# Altium project updated_loraxbee.PrjPcb
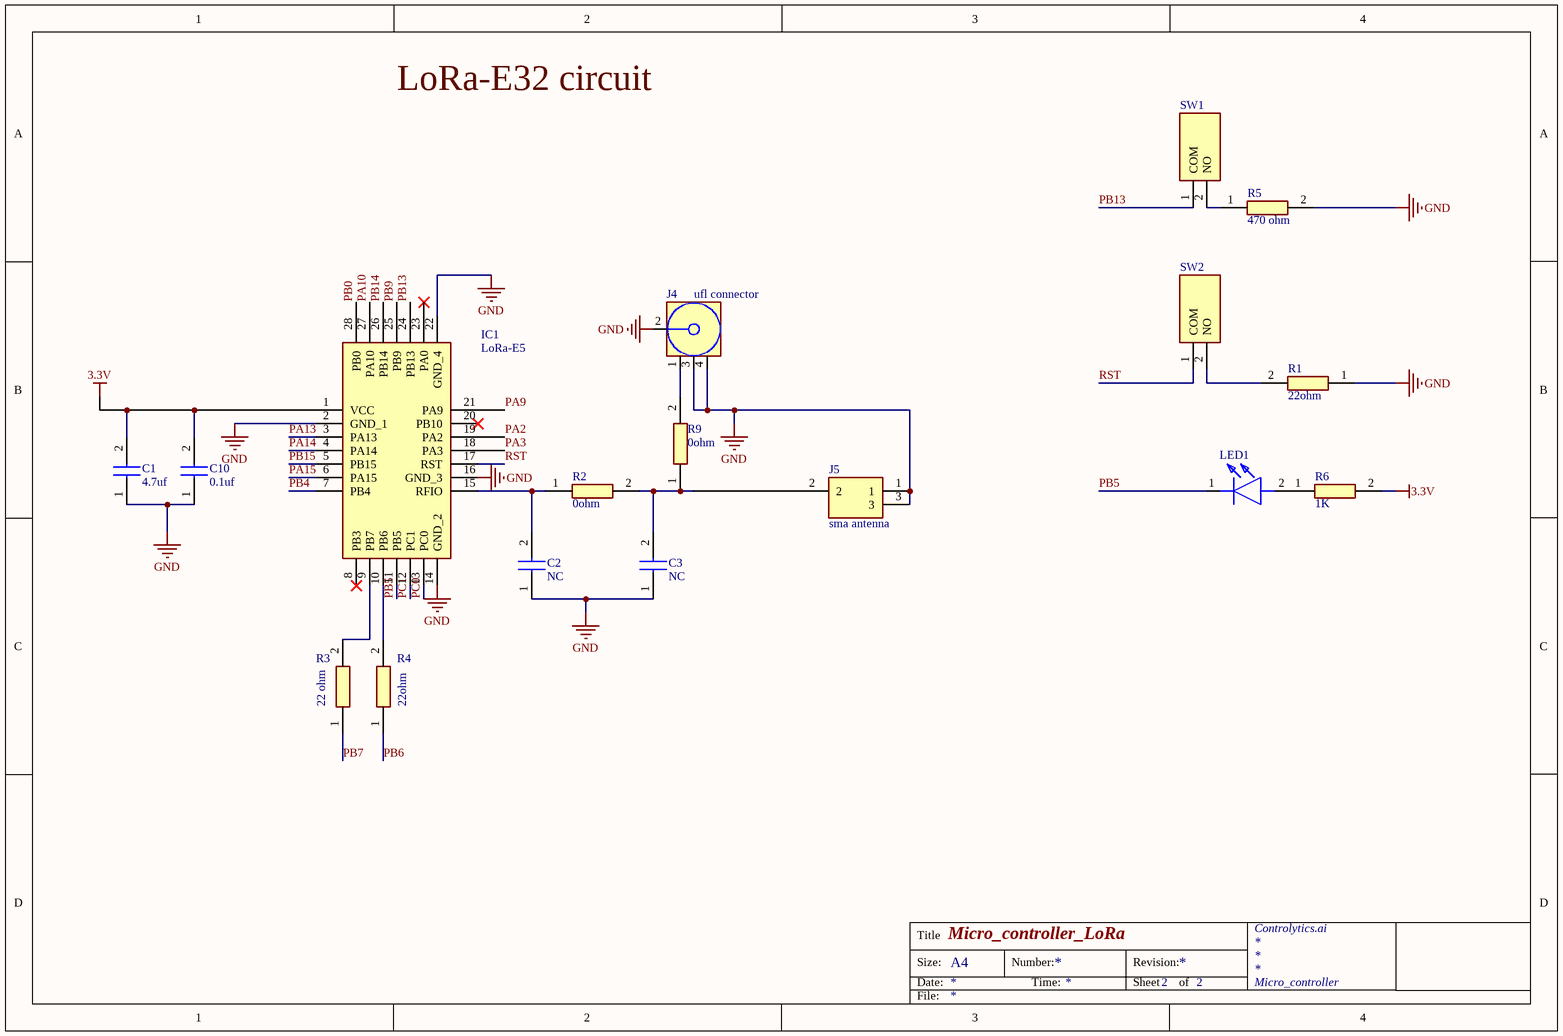
[diagram p0: updatedLoraXbee.SchDoc]
2 sheets, 30 parts. Net scope: global (net labels, ports and power ports of the same name join across sheets).
Board file: updated_lloraxbee2.PcbDoc
Sheets:
  updatedLoraXbee.SchDoc
  updated_loraxbee_ldo sheet.SchDoc

## Sheet updatedLoraXbee.SchDoc: Micro_controller_LoRa
size A4; Organization: Controlytics.ai; Address4: Micro_controller; SheetNumber: 2; SheetTotal: 2

### Parts
C1  4.7uf  [CAPC1608X100N]
C2  NC  [CAPC1608X90N]
C3  NC  [CAPC1608X90N]
C10  0.1uf  [CAPC1608X100N]
IC1  LoRa-E5  [LoRaE5]
J4  ufl connector  [SMA_EDGE_5_6.4x7.8]
J5  sma antenna  [1909763-1]
LED1  FKR1111C-TR  [LED-0603-BLUE]  (value not drawn)
R1  22ohm  [RESC1609X55N]
R2  0ohm  [RESC1608X55N]
R3  22 ohm  [RESC1609X55N]
R4  22ohm  [RESC1609X55N]
R5  470 ohm  [RESC1608X55N]
R6  1K  [ERA3AEB101V]
R9  0ohm  [RESC1608X55N]
SW1  PTS636_SK25F_SMTR_LFS  [PTS636SK25FSMTRLFS]  (value not drawn)
SW2  PTS636_SK25F_SMTR_LFS  [PTS636SK25FSMTRLFS]  (value not drawn)

### Nets
3.3V: C1.2 C10.2 IC1.1(VCC) R6.2
GND: C1.1 C2.1 C3.1 C10.1 IC1.2(GND_1) IC1.14(GND_2) IC1.16(GND_3) IC1.22(GND_4) J4.2(Signal) J4.3(GND) J4.4(GND) J5.1 J5.3 R1.1 R5.2
PA2: IC1.19(PA2)
PA3: IC1.18(PA3)
PA9: IC1.21(PA9)
PA10: IC1.27(PA10)
PA13: IC1.3(PA13)
PA14: IC1.4(PA14)
PA15: IC1.6(PA15)
PB0: IC1.28(PB0)
PB4: IC1.7(PB4)
PB5: IC1.11(PB5) LED1.1(K)
PB6: R4.1
PB7: R3.1
PB9: IC1.25(PB9)
PB13: IC1.24(PB13) SW1.1(COM)
PB14: IC1.26(PB14)
PB15: IC1.5(PB15)
PC0: IC1.13(PC0)
PC1: IC1.12(PC1)
RST: IC1.17(RST) SW2.1(COM)
NetC2_2: C2.2 IC1.15(RFIO) R2.1
NetC3_2: C3.2 J5.2 R2.2 R9.1
NetIC1_9: IC1.9(PB7) R3.2
NetIC1_10: IC1.10(PB6) R4.2
NetJ4_1: J4.1(GND) R9.2
NetLED1_2: LED1.2(A) R6.1
NetR1_2: R1.2 SW2.2(NO)
NetR5_1: R5.1 SW1.2(NO)

Not connected (* = marked no-connect by the designer): IC1 8(PB3)* 20(PB10)* 23(PA0)*

### Notes on the sheet
- LoRa-E32 circuit
- Title
- Size:
- Date:
- A4
- Number:
- Time:
- Revision:
- Sheet
- of
- File:

### Library data of the parts
C1 C10 = GCJ188C70J475KE02D: Capacitor; Manufacturer_Name: Murata Electronics; Datasheet Link: https://psearch.en.murata.com/capacitor/product/GCJ188C70J475KE02%23.html; Height: 1mm; Manufacturer_Part_Number: GCJ188C70J475KE02D; Mouser Part Number: 81-GCJ188C70J475KE2D; Mouser Price/Stock: https://www.mouser.co.uk/ProductDetail/Murata-Electronics/GCJ188C70J475KE02D?qs=QzBtWTOodeVfJR8CElrI4A%3D%3D; Arrow Part Number: GCJ188C70J475KE02D; Arrow Price/Stock: https://www.arrow.com/en/products/gcj188c70j475ke02d/murata-manufacturing?region=nac
C2 C3 = GRM188R71C104MA01D: Capacitor; Manufacturer_Name: Murata Electronics; Datasheet Link: http://componentsearchengine.com/Datasheets/1/GRM188R71C104MA01D.pdf; Height: 0.9mm; Manufacturer_Part_Number: GRM188R71C104MA01D; Mouser Part Number: 81-GRM18R71C104MA01D; Mouser Price/Stock: https://www.mouser.com/Search/Refine.aspx?Keyword=81-GRM18R71C104MA01D; Arrow Part Number: GRM188R71C104MA01D; Arrow Price/Stock: https://www.arrow.com/en/products/grm188r71c104ma01d/murata-manufacturing
IC1 = LoRa-E5: Integrated Circuit; Manufacturer_Name: Seeed Studio; Datasheet Link: https://no.mouser.com/datasheet/2/744/LoRa_E5_module_datasheet_V1_0-2488126.pdf; Height: 2.5mm; Manufacturer_Part_Number: LoRa-E5
J4 = SMA_CON_4: ComponentLink1URL: http://www.amphenolrf.com/media/downloads/3672/132372-11.pdf; ComponentLink1Description: http://www.amphenolrf.com/media/downloads/3672/132372-11.pdf
J5 = 1909763-1: Connector; Manufacturer_Name: TE Connectivity; Datasheet Link: http://www.te.com/commerce/DocumentDelivery/DDEController?Action=srchrtrv&DocNm=1909763&DocType=Customer+Drawing&DocLang=English; Manufacturer_Part_Number: 1909763-1; Mouser Part Number: 571-1909763-1; Mouser Price/Stock: https://www.mouser.co.uk/ProductDetail/TE-Connectivity-AMP/1909763-1?qs=zR8VgEwoOb2%252BUqFkM9%2F6jQ%3D%3D; Arrow Part Number: 1909763-1; Arrow Price/Stock: https://www.arrow.com/en/products/1909763-1/te-connectivity?region=nac
LED1 = FKR1111C-TR: LED; Manufacturer_Name: Stanley Electric; Datasheet Link: http://www.stanley-components.com/php/downloaddatafile.php?rp=0,FKR1111C-TR_e.pdf; Height: 0.8mm; Manufacturer_Part_Number: FKR1111C-TR; Mouser Part Number: 327-FKR1111CTR; Mouser Price/Stock: https://www.mouser.co.uk/ProductDetail/Stanley-Electric/FKR1111C-TR?qs=byeeYqUIh0N4LNttpqKOoA%3D%3D; Arrow Part Number: FKR1111C-TR; Arrow Price/Stock: https://www.arrow.com/en/products/fkr1111c-tr/stanley-electric?region=nac
R1 R3 R4 = ERJ-P03J220V: Resistor; Manufacturer_Name: Panasonic; Datasheet Link: http://industrial.panasonic.com/cdbs/www-data/pdf/RDA0000/AOA0000C102.pdf; Height: 0.55mm; Manufacturer_Part_Number: ERJ-P03J220V; Mouser Part Number: 667-ERJ-P03J220V; Mouser Price/Stock: https://www.mouser.co.uk/ProductDetail/Panasonic/ERJ-P03J220V?qs=18kBAoNi3c8s2FjgUUqr2Q%3D%3D
R2 R9 = MCT0603HZ0000ZP500: Resistor; Manufacturer_Name: Vishay; Datasheet Link: http://www.vishay.com/docs/28705/mcx0x0xpro.pdf; Height: 0.55mm; Manufacturer_Part_Number: MCT0603HZ0000ZP500; Mouser Part Number: 594-MCT0603HZ0000ZP5; Mouser Price/Stock: https://www.mouser.co.uk/ProductDetail/Vishay-Beyschlag/MCT0603HZ0000ZP500?qs=xy8ZAJ6gwchPwuxyJv%252BYaw%3D%3D; Arrow Part Number: MCT0603HZ0000ZP500; Arrow Price/Stock: https://www.arrow.com/en/products/mct0603hz0000zp500/vishay?region=nac
R5 = ERJ-S03F4700V: Resistor; Manufacturer_Name: Panasonic; Datasheet Link: https://industrial.panasonic.com/cdbs/www-data/pdf/RDP0000/AOA0000C334.pdf; Height: 0.55mm; Manufacturer_Part_Number: ERJ-S03F4700V; Mouser Part Number: 667-ERJ-S03F4700V; Mouser Price/Stock: https://www.mouser.co.uk/ProductDetail/Panasonic/ERJ-S03F4700V?qs=Zyl8A9hlmJo8QyiDzgvbZA%3D%3D
R6 = ERA-3AED102V: Resistor; Manufacturer_Name: Panasonic; Datasheet Link: https://industrial.panasonic.com/cdbs/www-data/pdf/RDM0000/AOA0000C307.pdf; Height: 0.55mm; Manufacturer_Part_Number: ERA-3AED102V; Mouser Part Number: 667-ERA-3AED102V; Mouser Price/Stock: https://www.mouser.co.uk/ProductDetail/Panasonic/ERA-3AED102V?qs=yocZuyCaXdNrh6oeFjCchg%3D%3D; Arrow Part Number: ERA-3AED102V; Arrow Price/Stock: https://www.arrow.com/en/products/era3aed102v/panasonic?region=nac
SW1 SW2 = SW1_PTS636_SK25F_SMTR_LFS-SMT: Switch; Manufacturer_Name: C & K COMPONENTS; Manufacturer_Part_Number: PTS636 SK25F SMTR LFS; Datasheet Link: https://www.mouser.com/datasheet/2/60/pts636-1550567.pdf; Height: 2.7mm; Mouser Part Number: 611-PTS636SK25FSMTRL; Mouser Price/Stock: https://www.mouser.co.uk/ProductDetail/CK/PTS636-SK25F-SMTR-LFS?qs=vLWxofP3U2zO9PvdsA2GhQ%3D%3D; Arrow Part Number: PTS636 SK25F SMTR LFS; Arrow Price/Stock: https://www.arrow.com/en/products/pts636-sk25f-smtr-lfs/ck

## Sheet updated_loraxbee_ldo sheet.SchDoc
size A4; SheetNumber: 1; SheetTotal: 2
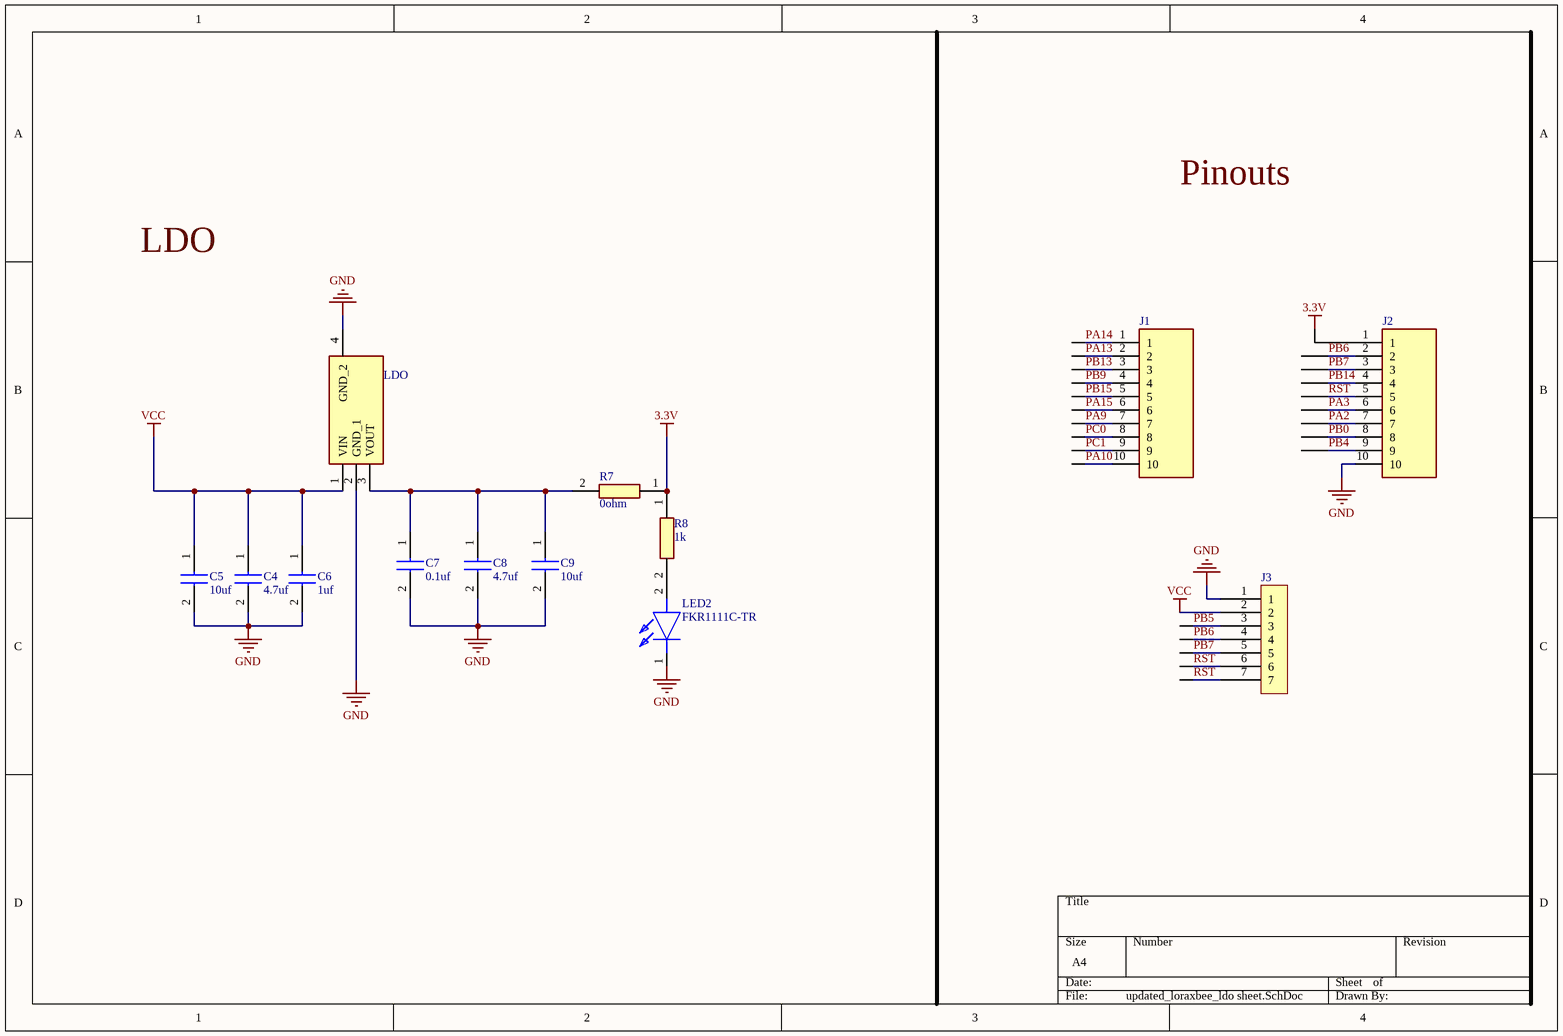
[diagram p1: updated_loraxbee_ldo sheet.SchDoc]

### Parts
C4  4.7uf  [CAPC1608X100N]
C5  10uf  [CAPC1608X100N]
C6  1uf  [CAPC1608X100N]
C7  0.1uf  [CAPC1608X100N]
C8  4.7uf  [CAPC1608X100N]
C9  10uf  [CAPC1608X100N]
J1  2MM-HB-S10-VT-02-H-TB  [HDRV10W53P0X200_1X10_1980X200X555P]  (value not drawn)
J2  2MM-HB-S10-VT-02-H-TB  [HDRV10W53P0X200_1X10_1980X200X555P]  (value not drawn)
J3  7 pin 2.54mm pitch header  [2.5mm 7 pin header]  (value not drawn)
LDO  TC1264-3.3VDB  [SOT230P700X180-4N]  (value not drawn)
LED2  FKR1111C-TR  [LED-0603-BLUE]
R7  0ohm  [RESC1608X55N]
R8  1k  [RESC1608X55N]

### Nets
3.3V: J2.1 R7.1 R8.1
GND: C4.2 C5.2 C6.2 C7.2 C8.2 C9.2 J2.10 J3.1 LDO.2(GND_1) LDO.4(GND_2) LED2.1(K)
VCC: C4.1 C5.1 C6.1 J3.2 LDO.1(VIN)
PA2: J2.7
PA3: J2.6
PA9: J1.7
PA10: J1.10
PA13: J1.2
PA14: J1.1
PA15: J1.6
PB0: J2.8
PB4: J2.9
PB5: J3.3
PB6: J2.2 J3.4
PB7: J2.3 J3.5
PB9: J1.4
PB13: J1.3
PB14: J2.4
PB15: J1.5
PC0: J1.8
PC1: J1.9
RST: J2.5 J3.6 J3.7
NetC7_1: C7.1 C8.1 C9.1 LDO.3(VOUT) R7.2
NetLED2_2: LED2.2(A) R8.2

### Notes on the sheet
- Pinouts
- LDO

### Library data of the parts
C4-C9 = GCJ188C70J475KE02D: as C1 on sheet updatedLoraXbee; Datasheet Link: https://psearch.en.murata.com/capacitor/product/GCJ188C70J475KE02%23.html; Height: 1mm; Manufacturer_Part_Number: GCJ188C70J475KE02D; Mouser Part Number: 81-GCJ188C70J475KE2D; Mouser Price/Stock: https://www.mouser.co.uk/ProductDetail/Murata-Electronics/GCJ188C70J475KE02D?qs=QzBtWTOodeVfJR8CElrI4A%3D%3D; Arrow Part Number: GCJ188C70J475KE02D; Arrow Price/Stock: https://www.arrow.com/en/products/gcj188c70j475ke02d/murata-manufacturing?region=nac
J1 J2 = 2MM-HB-S10-VT-02-H-TB: Connector; Manufacturer_Name: TE Connectivity; Datasheet Link: https://www.mouser.com/datasheet/2/418/9/ENG_DS_1_1773952_5_1915-3118174.pdf; Height: 5.55mm; Manufacturer_Part_Number: 2MM-HB-S10-VT-02-H-TB; Mouser Part Number: 571-2MM-HBS10VT02HTB; Mouser Price/Stock: https://www.mouser.co.uk/ProductDetail/TE-Connectivity/2MM-HB-S10-VT-02-H-TB?qs=9vOqFld9vZW8PvcL2%252Bd%2FMA%3D%3D
LDO = TC1264-3.3VDB: Integrated Circuit; Manufacturer_Name: Microchip; Datasheet Link: http://ww1.microchip.com/downloads/en/devicedoc/21375d.pdf; Height: 1.8mm; Manufacturer_Part_Number: TC1264-3.3VDB; Mouser Part Number: 579-TC1264-3.3VDB; Mouser Price/Stock: https://www.mouser.co.uk/ProductDetail/Microchip-Technology/TC1264-3.3VDB?qs=AkCjCAp%252BzjQSxS5e2ugTcA%3D%3D; Arrow Part Number: TC1264-3.3VDB; Arrow Price/Stock: https://www.arrow.com/en/products/tc1264-3.3vdb/microchip-technology?region=nac
LED2 = FKR1111C-TR: LED; Manufacturer_Name: Stanley Electric; Datasheet Link: http://www.stanley-components.com/php/downloaddatafile.php?rp=0,FKR1111C-TR_e.pdf; Height: 0.8mm; Manufacturer_Part_Number: FKR1111C-TR; Mouser Part Number: 327-FKR1111CTR; Mouser Price/Stock: https://www.mouser.co.uk/ProductDetail/Stanley-Electric/FKR1111C-TR?qs=byeeYqUIh0N4LNttpqKOoA%3D%3D; Arrow Part Number: FKR1111C-TR; Arrow Price/Stock: https://www.arrow.com/en/products/fkr1111c-tr/stanley-electric?region=nac
R7 R8 = MCT0603HZ0000ZP500: Resistor; Manufacturer_Name: Vishay; Datasheet Link: http://www.vishay.com/docs/28705/mcx0x0xpro.pdf; Height: 0.55mm; Manufacturer_Part_Number: MCT0603HZ0000ZP500; Mouser Part Number: 594-MCT0603HZ0000ZP5; Mouser Price/Stock: https://www.mouser.co.uk/ProductDetail/Vishay-Beyschlag/MCT0603HZ0000ZP500?qs=xy8ZAJ6gwchPwuxyJv%252BYaw%3D%3D; Arrow Part Number: MCT0603HZ0000ZP500; Arrow Price/Stock: https://www.arrow.com/en/products/mct0603hz0000zp500/vishay?region=nac

## Nets that join several sheets
3.3V: updatedLoraXbee (C1.2 C10.2 IC1.1 R6.2), updated_loraxbee_ldo sheet (J2.1 R7.1 R8.1)
GND: updatedLoraXbee (15 pins), updated_loraxbee_ldo sheet (11 pins)
PA2: updatedLoraXbee (IC1.19), updated_loraxbee_ldo sheet (J2.7)
PA3: updatedLoraXbee (IC1.18), updated_loraxbee_ldo sheet (J2.6)
PA9: updatedLoraXbee (IC1.21), updated_loraxbee_ldo sheet (J1.7)
PA10: updatedLoraXbee (IC1.27), updated_loraxbee_ldo sheet (J1.10)
PA13: updatedLoraXbee (IC1.3), updated_loraxbee_ldo sheet (J1.2)
PA14: updatedLoraXbee (IC1.4), updated_loraxbee_ldo sheet (J1.1)
PA15: updatedLoraXbee (IC1.6), updated_loraxbee_ldo sheet (J1.6)
PB0: updatedLoraXbee (IC1.28), updated_loraxbee_ldo sheet (J2.8)
PB4: updatedLoraXbee (IC1.7), updated_loraxbee_ldo sheet (J2.9)
PB5: updatedLoraXbee (IC1.11 LED1.1), updated_loraxbee_ldo sheet (J3.3)
PB6: updatedLoraXbee (R4.1), updated_loraxbee_ldo sheet (J2.2 J3.4)
PB7: updatedLoraXbee (R3.1), updated_loraxbee_ldo sheet (J2.3 J3.5)
PB9: updatedLoraXbee (IC1.25), updated_loraxbee_ldo sheet (J1.4)
PB13: updatedLoraXbee (IC1.24 SW1.1), updated_loraxbee_ldo sheet (J1.3)
PB14: updatedLoraXbee (IC1.26), updated_loraxbee_ldo sheet (J2.4)
PB15: updatedLoraXbee (IC1.5), updated_loraxbee_ldo sheet (J1.5)
PC0: updatedLoraXbee (IC1.13), updated_loraxbee_ldo sheet (J1.8)
PC1: updatedLoraXbee (IC1.12), updated_loraxbee_ldo sheet (J1.9)
RST: updatedLoraXbee (IC1.17 SW2.1), updated_loraxbee_ldo sheet (J2.5 J3.6 J3.7)